# Altium schematic sheet USB_MNG_RS.SchDoc
size 381 x 241 mm; SheetNumber: 3; SheetTotal: 3
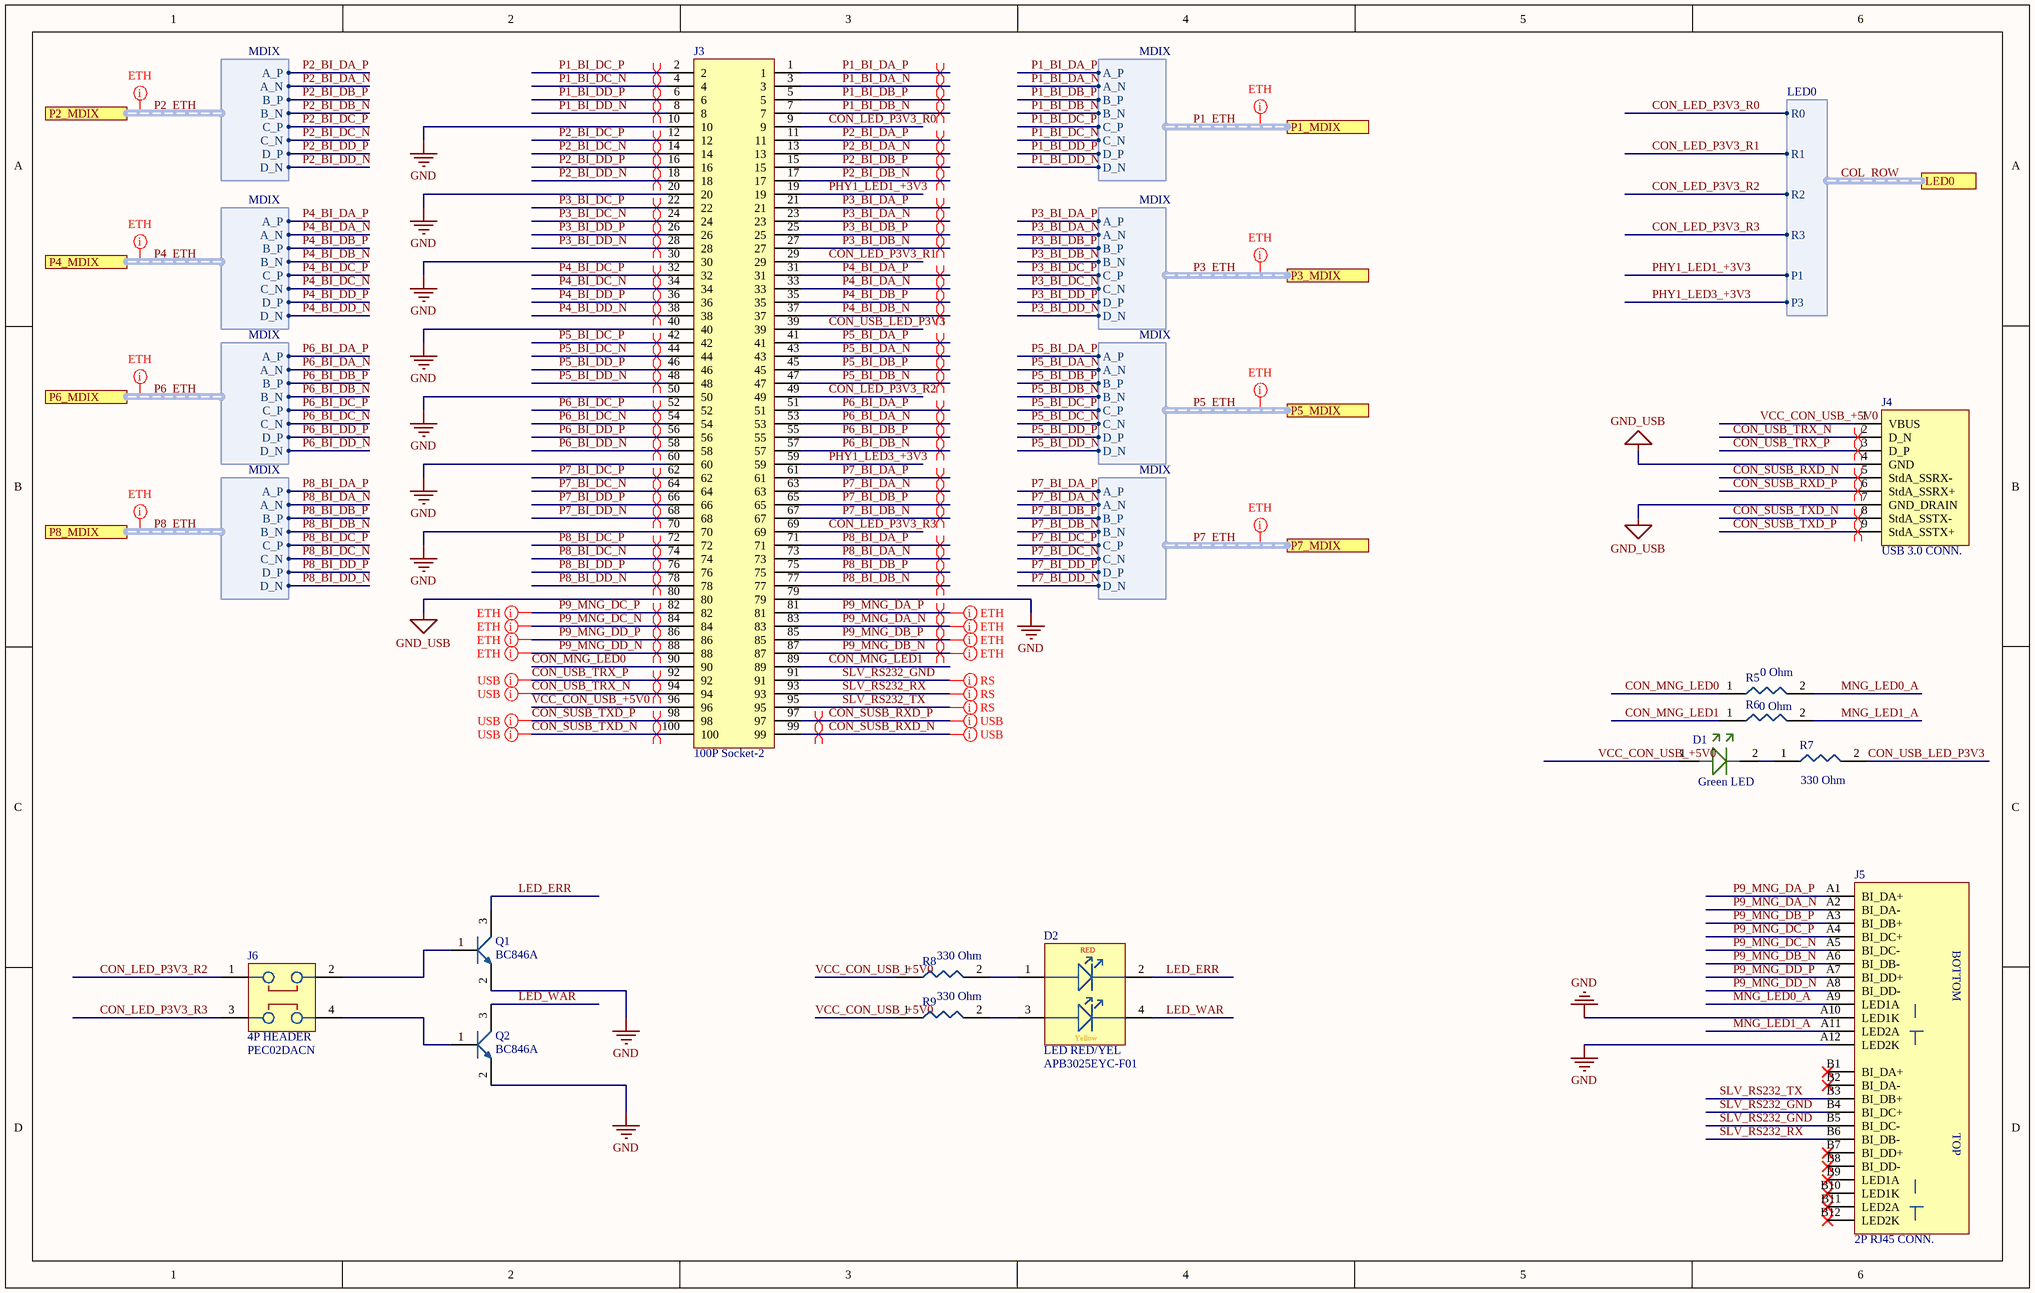
[diagram p0: USB_MNG_RS.SchDoc]

## Parts
D1  Green LED  [Green LED]
D2  LED RED/YEL  Order Number: APB3025EYC-F01  [LED RED/YLW]
J3  100P Socket-2  [100P SOCKET]
J4  USB 3.0 CONN.  [USB 3.0 CONN.]
J5  2P RJ45 CONN.  [2P RJ45 CONN.]
J6  4P HEADER  Order Number: PEC02DACN  [4P HEADER]
Q1  BC846A  [BC846A]
Q2  BC846A  [BC846A]
R5  value 0 Ohm  [0 Ohm Res.]  (hidden comment: 0 Ohm Res.)
R6  value 0 Ohm  [0 Ohm Res.]  (hidden comment: 0 Ohm Res.)
R7  value 330 Ohm  [330 Ohm RES.]  (hidden comment: 330 Ohm RES)
R8  value 330 Ohm  [330 Ohm RES.]  (hidden comment: 330 Ohm RES)
R9  value 330 Ohm  [330 Ohm RES.]  (hidden comment: 330 Ohm RES)

## Ports
LED0 (harness LED0), P1_MDIX (harness MDIX), P2_MDIX (harness MDIX), P3_MDIX (harness MDIX), P4_MDIX (harness MDIX), P5_MDIX (harness MDIX), P6_MDIX (harness MDIX), P7_MDIX (harness MDIX), P8_MDIX (harness MDIX)

## Harnesses
MDIX: A_P, A_N, B_P, B_N, C_N, D_P, D_N, C_P
MDIX: D_N, D_P, C_N, C_P, B_P, A_N, A_P, B_N
LED0: R0, R1, R2, R3, P1, P3

## Nets
GND: J3.10 J3.20 J3.30 J3.40 J3.50 J3.60 J3.70 J3.79 J5.A10(LED1K) J5.A12(LED2K) Q1.2 Q2.2
GND_USB: J3.80 J4.4(GND) J4.7(GND_DRAIN)
CON_LED_P3V3_R0: J3.9 ; port LED0.R0  [project net COL_ROW.R0]
CON_LED_P3V3_R1: J3.29 ; port LED0.R1  [project net COL_ROW.R1]
CON_LED_P3V3_R2: J3.49 J6.1 ; port LED0.R2  [project net COL_ROW.R2]
CON_LED_P3V3_R3: J3.69 J6.3 ; port LED0.R3  [project net COL_ROW.R3]
CON_MNG_LED0: J3.90 R5.1
CON_MNG_LED1: J3.89 R6.1
CON_SUSB_RXD_N: J3.99 J4.5(StdA_SSRX-)
CON_SUSB_RXD_P: J3.97 J4.6(StdA_SSRX+)
CON_SUSB_TXD_N: J3.100 J4.8(StdA_SSTX-)
CON_SUSB_TXD_P: J3.98 J4.9(StdA_SSTX+)
CON_USB_LED_P3V3: J3.39 R7.2
CON_USB_TRX_N: J3.94 J4.2(D_N)
CON_USB_TRX_P: J3.92 J4.3(D_P)
LED_ERR: D2.2 Q1.3
LED_WAR: D2.4 Q2.3
MNG_LED0_A: J5.A9(LED1A) R5.2
MNG_LED1_A: J5.A11(LED2A) R6.2
P1_BI_DA_N: J3.3 ; port P1_MDIX.A_N
P1_BI_DA_P: J3.1 ; port P1_MDIX.A_P
P1_BI_DB_N: J3.7 ; port P1_MDIX.B_N
P1_BI_DB_P: J3.5 ; port P1_MDIX.B_P
P1_BI_DC_N: J3.4 ; port P1_MDIX.C_N
P1_BI_DC_P: J3.2 ; port P1_MDIX.C_P
P1_BI_DD_N: J3.8 ; port P1_MDIX.D_N
P1_BI_DD_P: J3.6 ; port P1_MDIX.D_P
P2_BI_DA_N: J3.13 ; port P2_MDIX.A_N
P2_BI_DA_P: J3.11 ; port P2_MDIX.A_P
P2_BI_DB_N: J3.17 ; port P2_MDIX.B_N
P2_BI_DB_P: J3.15 ; port P2_MDIX.B_P
P2_BI_DC_N: J3.14 ; port P2_MDIX.C_N
P2_BI_DC_P: J3.12 ; port P2_MDIX.C_P
P2_BI_DD_N: J3.18 ; port P2_MDIX.D_N
P2_BI_DD_P: J3.16 ; port P2_MDIX.D_P
P3_BI_DA_N: J3.23 ; port P3_MDIX.A_N
P3_BI_DA_P: J3.21 ; port P3_MDIX.A_P
P3_BI_DB_N: J3.27 ; port P3_MDIX.B_N
P3_BI_DB_P: J3.25 ; port P3_MDIX.B_P
P3_BI_DC_N: J3.24 ; port P3_MDIX.C_N
P3_BI_DC_P: J3.22 ; port P3_MDIX.C_P
P3_BI_DD_N: J3.28 ; port P3_MDIX.D_N
P3_BI_DD_P: J3.26 ; port P3_MDIX.D_P
P4_BI_DA_N: J3.33 ; port P4_MDIX.A_N
P4_BI_DA_P: J3.31 ; port P4_MDIX.A_P
P4_BI_DB_N: J3.37 ; port P4_MDIX.B_N
P4_BI_DB_P: J3.35 ; port P4_MDIX.B_P
P4_BI_DC_N: J3.34 ; port P4_MDIX.C_N
P4_BI_DC_P: J3.32 ; port P4_MDIX.C_P
P4_BI_DD_N: J3.38 ; port P4_MDIX.D_N
P4_BI_DD_P: J3.36 ; port P4_MDIX.D_P
P5_BI_DA_N: J3.43 ; port P5_MDIX.A_N
P5_BI_DA_P: J3.41 ; port P5_MDIX.A_P
P5_BI_DB_N: J3.47 ; port P5_MDIX.B_N
P5_BI_DB_P: J3.45 ; port P5_MDIX.B_P
P5_BI_DC_N: J3.44 ; port P5_MDIX.C_N
P5_BI_DC_P: J3.42 ; port P5_MDIX.C_P
P5_BI_DD_N: J3.48 ; port P5_MDIX.D_N
P5_BI_DD_P: J3.46 ; port P5_MDIX.D_P
P6_BI_DA_N: J3.53 ; port P6_MDIX.A_N
P6_BI_DA_P: J3.51 ; port P6_MDIX.A_P
P6_BI_DB_N: J3.57 ; port P6_MDIX.B_N
P6_BI_DB_P: J3.55 ; port P6_MDIX.B_P
P6_BI_DC_N: J3.54 ; port P6_MDIX.C_N
P6_BI_DC_P: J3.52 ; port P6_MDIX.C_P
P6_BI_DD_N: J3.58 ; port P6_MDIX.D_N
P6_BI_DD_P: J3.56 ; port P6_MDIX.D_P
P7_BI_DA_N: J3.63 ; port P7_MDIX.A_N
P7_BI_DA_P: J3.61 ; port P7_MDIX.A_P
P7_BI_DB_N: J3.67 ; port P7_MDIX.B_N
P7_BI_DB_P: J3.65 ; port P7_MDIX.B_P
P7_BI_DC_N: J3.64 ; port P7_MDIX.C_N
P7_BI_DC_P: J3.62 ; port P7_MDIX.C_P
P7_BI_DD_N: J3.68 ; port P7_MDIX.D_N
P7_BI_DD_P: J3.66 ; port P7_MDIX.D_P
P8_BI_DA_N: J3.73 ; port P8_MDIX.A_N
P8_BI_DA_P: J3.71 ; port P8_MDIX.A_P
P8_BI_DB_N: J3.77 ; port P8_MDIX.B_N
P8_BI_DB_P: J3.75 ; port P8_MDIX.B_P
P8_BI_DC_N: J3.74 ; port P8_MDIX.C_N
P8_BI_DC_P: J3.72 ; port P8_MDIX.C_P
P8_BI_DD_N: J3.78 ; port P8_MDIX.D_N
P8_BI_DD_P: J3.76 ; port P8_MDIX.D_P
P9_MNG_DA_N: J3.83 J5.A2(BI_DA-)
P9_MNG_DA_P: J3.81 J5.A1(BI_DA+)
P9_MNG_DB_N: J3.87 J5.A6(BI_DB-)
P9_MNG_DB_P: J3.85 J5.A3(BI_DB+)
P9_MNG_DC_N: J3.84 J5.A5(BI_DC-)
P9_MNG_DC_P: J3.82 J5.A4(BI_DC+)
P9_MNG_DD_N: J3.88 J5.A8(BI_DD-)
P9_MNG_DD_P: J3.86 J5.A7(BI_DD+)
PHY1_LED1_+3V3: J3.19 ; port LED0.P1  [project net COL_ROW.P1]
PHY1_LED3_+3V3: J3.59 ; port LED0.P3  [project net COL_ROW.P3]
SLV_RS232_GND: J3.91 J5.B4(BI_DC+) J5.B5(BI_DC-)
SLV_RS232_RX: J3.93 J5.B6(BI_DB-)
SLV_RS232_TX: J3.95 J5.B3(BI_DB+)
VCC_CON_USB_+5V0: D1.1(PVCC) J3.96 J4.1(VBUS) R8.1 R9.1
NetD1_2: D1.2(PVCC) R7.1
NetD2_1: D2.1 R8.2
NetD2_3: D2.3 R9.2
NetJ6_2: J6.2 Q1.1
NetJ6_4: J6.4 Q2.1

Not connected (* = marked no-connect by the designer): J5 B1(BI_DA+)* B2(BI_DA-)* B7(BI_DD+)* B8(BI_DD-)* B9(LED1A)* B10(LED1K)* B11(LED2A)* B12(LED2K)*

## Buses and harness runs
harness COL_ROW = port LED0
harness P1_ETH = port P1_MDIX
harness P2_ETH = port P2_MDIX
harness P3_ETH = port P3_MDIX
harness P4_ETH = port P4_MDIX
harness P5_ETH = port P5_MDIX
harness P6_ETH = port P6_MDIX
harness P7_ETH = port P7_MDIX
harness P8_ETH = port P8_MDIX

## Layout directives
differential pair: CON_SUSB_RXD_N, CON_SUSB_RXD_P, CON_SUSB_TXD_N, CON_SUSB_TXD_P, CON_USB_TRX_N, CON_USB_TRX_P, P1_BI_DA_N, P1_BI_DA_P, P1_BI_DB_N, P1_BI_DB_P, P1_BI_DC_N, P1_BI_DC_P, P1_BI_DD_N, P1_BI_DD_P, P2_BI_DA_N, P2_BI_DA_P, P2_BI_DB_N, P2_BI_DB_P, P2_BI_DC_N, P2_BI_DC_P, P2_BI_DD_N, P2_BI_DD_P, P3_BI_DA_N, P3_BI_DA_P, P3_BI_DB_N, P3_BI_DB_P, P3_BI_DC_N, P3_BI_DC_P, P3_BI_DD_N, P3_BI_DD_P, P4_BI_DA_N, P4_BI_DA_P, P4_BI_DB_N, P4_BI_DB_P, P4_BI_DC_N, P4_BI_DC_P, P4_BI_DD_N, P4_BI_DD_P, P5_BI_DA_N, P5_BI_DA_P, P5_BI_DB_N, P5_BI_DB_P, P5_BI_DC_N, P5_BI_DC_P, P5_BI_DD_N, P5_BI_DD_P, P6_BI_DA_N, P6_BI_DA_P, P6_BI_DB_N, P6_BI_DB_P, P6_BI_DC_N, P6_BI_DC_P, P6_BI_DD_N, P6_BI_DD_P, P7_BI_DA_N, P7_BI_DA_P, P7_BI_DB_N, P7_BI_DB_P, P7_BI_DC_N, P7_BI_DC_P, P7_BI_DD_N, P7_BI_DD_P, P8_BI_DA_N, P8_BI_DA_P, P8_BI_DB_N, P8_BI_DB_P, P8_BI_DC_N, P8_BI_DC_P, P8_BI_DD_N, P8_BI_DD_P, P9_MNG_DA_N, P9_MNG_DA_P, P9_MNG_DB_N, P9_MNG_DB_P, P9_MNG_DC_N, P9_MNG_DC_P, P9_MNG_DD_N, P9_MNG_DD_P
net class ETH: (no net found under the mark)
net class ETH; net class MNG: P9_MNG_DA_N, P9_MNG_DA_P, P9_MNG_DB_N, P9_MNG_DB_P, P9_MNG_DC_N, P9_MNG_DC_P, P9_MNG_DD_N, P9_MNG_DD_P
net class USB: CON_USB_TRX_N, CON_USB_TRX_P
net class S_USB: CON_SUSB_RXD_N, CON_SUSB_RXD_P, CON_SUSB_TXD_N, CON_SUSB_TXD_P
net class RS: SLV_RS232_GND, SLV_RS232_RX, SLV_RS232_TX

## Notes on the sheet
- (in symbol 2P RJ45 CONN.) BOTTOM; TOP
- (in symbol LED RED/YEL) RED; Yellow

## Library data of the parts
D1 = Green LED: Manufacturer: Everlight Electronics Co Ltd; Pin Number: 2; Order Number: QTLP601C4TR; Mounting Type: SMD; Price: $0.34; Value: Green LED
D2 = LED RED/YEL: Manufacturer: Kingbright; Pin Number: 4; Mounting Type: SMD; Price: $0.09
J3 = 100P Socket-2: 100P SMD Socket; Manufacturer: Samtec Inc.; Port Number: 100; Order Number: SFML-150-T2-L-D_NA; Mounting Type: SMD; Price: $20.16
J4 = USB 3.0 CONN.: USB 3.0 Connector; Manufacturer: Molex; Port Number: 1; Order Number: 0484040003; Mounting Type: Through Hole; Price: $2.72
J5 = 2P RJ45 CONN.: Manufacturer: Würth Elec.; Port Number: 2; Order Number: 615016240521; Mounting Type: Through Hole; Price: $9.52
J6 = 4P HEADER: 4 Position Male Header Connector; Manufacturer: Sullins Conn.; Pin Number: 4; Price: $0.47; Mounting Type: SMD
Q1 Q2 = BC846A: Manufacturer: Fairchild; Pin Number: 3; Price: $0.07; Mounting Type: SMD; Order Number: BC846A
R5 R6 = 0 Ohm Res.: 0 Ohm Resistor; Manufacturer: Panasonic; Pin Number: 2; Order Number: ERJ-6GEY0R00V; Mounting Type: SMD; Price: $0.10
R7-R9 = 330 Ohm RES: 330 Ohm SMD Resistor; Manufacturer: VISHAY; Pin Number: 2; Order Number: CRCW0805330RFKEA; Mounting Type: SMD; Price: $0.10